# EAGLE design ArdZeroBTHIDStickBckUp (EAGLE 8.6.0)
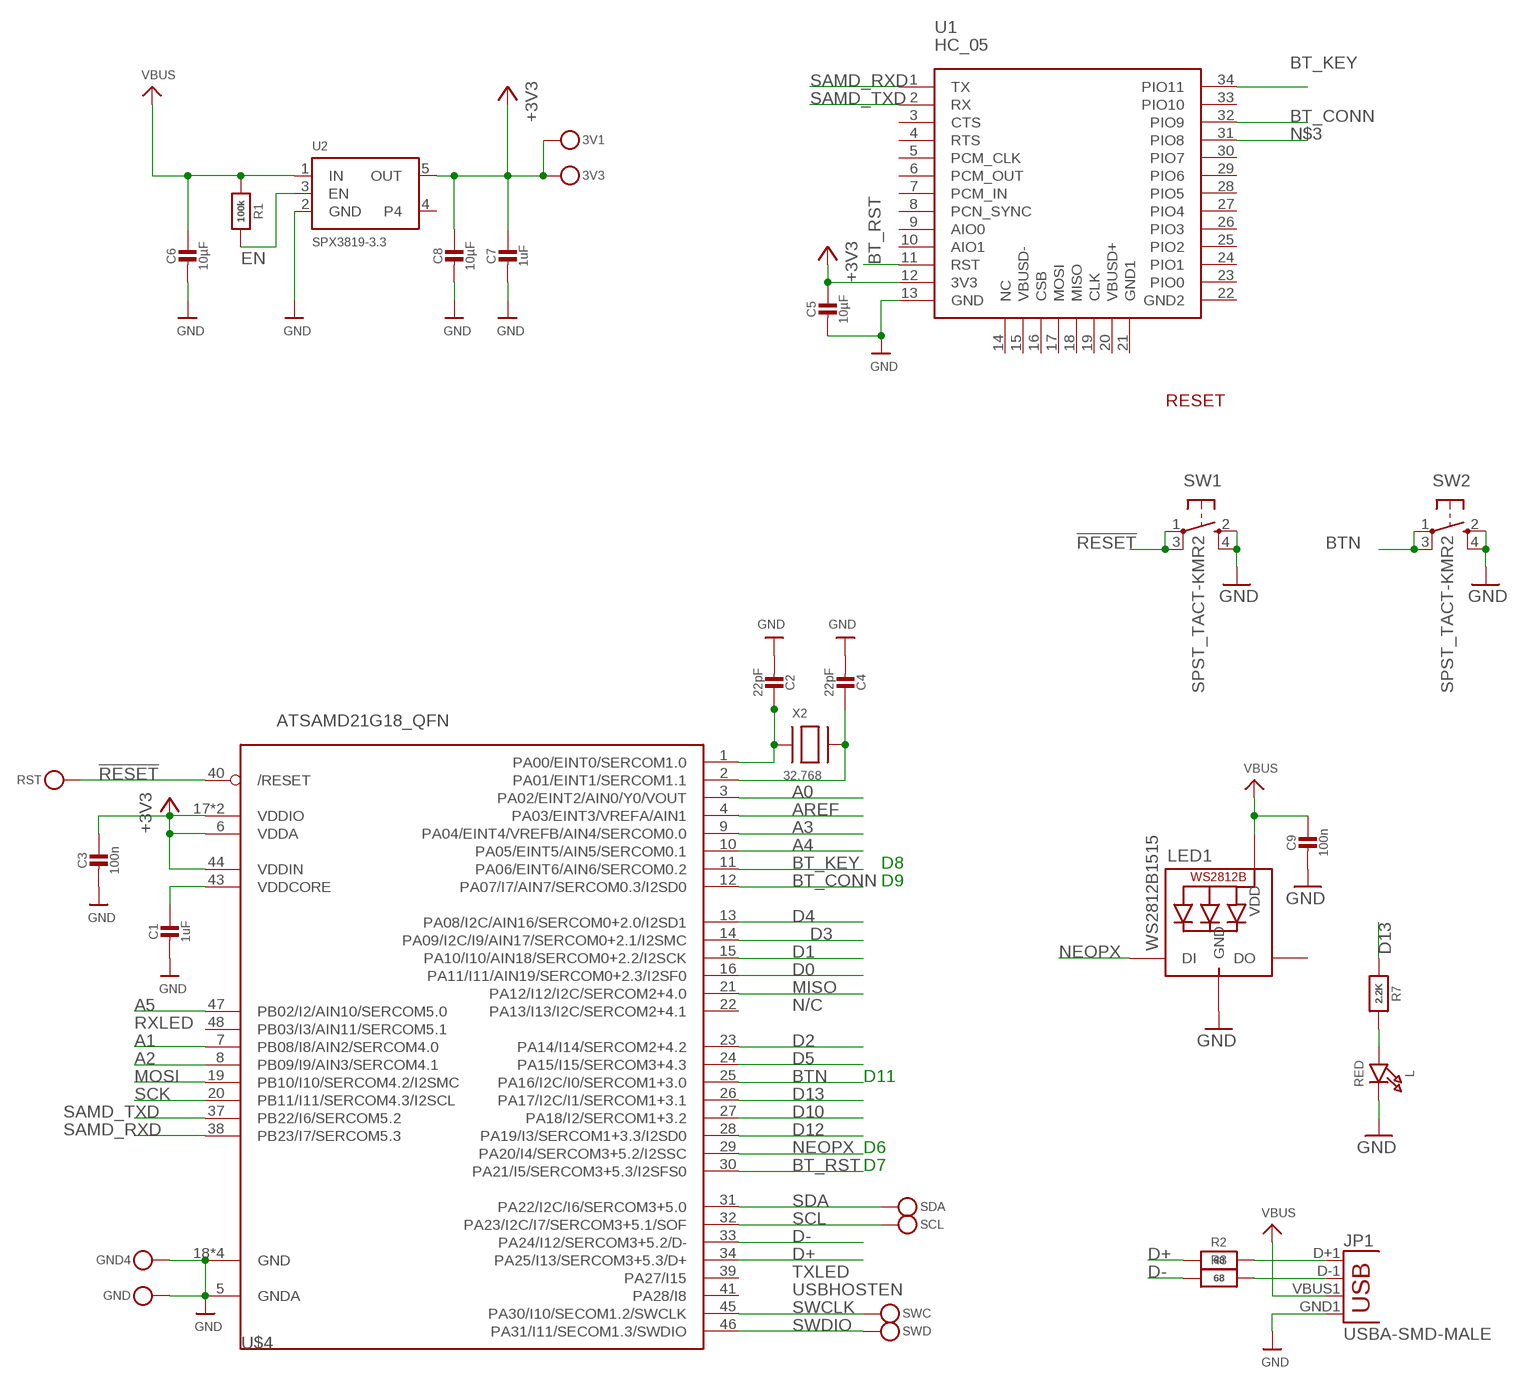
[diagram p0: schematic, sheet 1]

## Parts
3V1  TESTPOINTROUND1.5MM  [TESTPOINT_ROUND_1.5MM]
3V3  TESTPOINTROUND1.5MM  [TESTPOINT_ROUND_1.5MM]
C1  1uF  CAP_CERAMIC0603_NO  [0603-NO]
C2  22pF  CAP_CERAMIC0603_NO  [0603-NO]
C3  100n  CAP_CERAMIC0603_NO  [0603-NO]
C4  22pF  CAP_CERAMIC0603_NO  [0603-NO]
C5  10µF  CAP_CERAMIC0805-NOOUTLINE  [0805-NO]
C6  10µF  CAP_CERAMIC0805-NOOUTLINE  [0805-NO]
C7  1uF  CAP_CERAMIC0603_NO  [0603-NO]
C8  10µF  CAP_CERAMIC0805-NOOUTLINE  [0805-NO]
C9  100n  CAP_CERAMIC0603_NO  [0603-NO]
GND  TESTPOINTROUND1.5MM  [TESTPOINT_ROUND_1.5MM]
GND4  TESTPOINTROUND1.5MM  [TESTPOINT_ROUND_1.5MM]
JP1  USBA-SMD-MALE  [USB-A-SMT-MALE]
L  RED  LED0805_NOOUTLINE  [CHIPLED_0805_NOOUTLINE]
LED1  WS2812B1515  [LED1515]
R1  100k  RESISTOR_0603_NOOUT  [0603-NO]
R2  68  RESISTOR_0603_NOOUT  [0603-NO]
R3  68  RESISTOR_0603_NOOUT  [0603-NO]
R7  2.2K  RESISTOR_0603_NOOUT  [0603-NO]
RST  TESTPOINTROUND1.5MM  [TESTPOINT_ROUND_1.5MM]
SCL  TESTPOINTROUND1.5MM  [TESTPOINT_ROUND_1.5MM]
SDA  TESTPOINTROUND1.5MM  [TESTPOINT_ROUND_1.5MM]
SW1  SPST_TACT-KMR2  [KMR2]
SW2  SPST_TACT-KMR2  [KMR2]
SWC  TESTPOINTROUND1.5MM  [TESTPOINT_ROUND_1.5MM]
SWD  TESTPOINTROUND1.5MM  [TESTPOINT_ROUND_1.5MM]
U1  HC_05  [BLUETOOTH_SMD]
U2  SPX3819-3.3  VREG_SOT23-5  [SOT23-5]
U$4  ATSAMD21G18_QFN  ATSAMD21J_QFN  [TQFN48_7MM]
X2  32.768  XTAL-3.2X1.5  [XTAL3215]

## Nets
!RESET: RST.P$1 SW1.1(P) SW1.3(P1) U$4.40(/RESET)
+3V3: 3V1.P$1 3V3.P$1 C3.1 C5.1 C7.1 C8.1 U1.12(3V3) U2.5(OUT) U$4.6(VDDA) U$4.17(VDDIO) U$4.36(VDDIO) U$4.44(VDDIN)
A0: U$4.3(PA02/EINT2/AIN0/Y0/VOUT)
A1: U$4.7(PB08/I8/AIN2/SERCOM4.0)
A2: U$4.8(PB09/I9/AIN3/SERCOM4.1)
A3: U$4.9(PA04/EINT4/VREFB/AIN4/SERCOM0.0)
A4: U$4.10(PA05/EINT5/AIN5/SERCOM0.1)
A5: U$4.47(PB02/I2/AIN10/SERCOM5.0)
AREF: U$4.4(PA03/EINT3/VREFA/AIN1)
BT_CONN: U1.32(PIO9) U$4.12(PA07/I7/AIN7/SERCOM0.3/I2SD0)
BT_KEY: U1.34(PIO11) U$4.11(PA06/EINT6/AIN6/SERCOM0.2)
BT_RST: U1.11(RST) U$4.30(PA21/I5/SERCOM3+5.3/I2SFS0)
BTN: SW2.1(P) SW2.3(P1) U$4.25(PA16/I2C/I0/SERCOM1+3.0)
D0: U$4.16(PA11/I11/AIN19/SERCOM0+2.3/I2SF0)
D1: U$4.15(PA10/I10/AIN18/SERCOM0+2.2/I2SCK)
D2: U$4.23(PA14/I14/SERCOM2+4.2)
D3: U$4.14(PA09/I2C/I9/AIN17/SERCOM0+2.1/I2SMC)
D4: U$4.13(PA08/I2C/AIN16/SERCOM0+2.0/I2SD1)
D5: U$4.24(PA15/I15/SERCOM3+4.3)
D10: U$4.27(PA18/I2/SERCOM1+3.2)
D12: U$4.28(PA19/I3/SERCOM1+3.3/I2SD0)
D13: R7.1 U$4.26(PA17/I2C/I1/SERCOM1+3.1)
D+: R2.1 U$4.34(PA25/I13/SERCOM3+5.3/D+)
D-: R3.1 U$4.33(PA24/I12/SERCOM3+5.2/D-)
EN: R1.2 U2.3(EN)
GND: C1.2 C2.2 C3.2 C4.2 C5.2 C6.2 C7.2 C8.2 C9.2 GND4.P$1 GND.P$1 JP1.GND1(GND) L.C LED1.GND SW1.2(S) SW1.4(S1) SW2.2(S) SW2.4(S1) U1.13(GND) U2.2(GND) U$4.5(GNDA) U$4.18(GND) U$4.35(GND) U$4.42(GND) U$4.THERMAL(GND)
MISO: U$4.21(PA12/I12/I2C/SERCOM2+4.0)
MOSI: U$4.19(PB10/I10/SERCOM4.2/I2SMC)
N$1: JP1.D+1(D+) R2.2
N$3: U1.31(PIO8)
N$4: JP1.D-1(D-) R3.2
N$5: C2.1 U$4.1(PA00/EINT0/SERCOM1.0) X2.P$1
N$6: L.A R7.2
N$7: C4.1 U$4.2(PA01/EINT1/SERCOM1.1) X2.P$2
NEOPX: LED1.DIN(DI) U$4.29(PA20/I4/SERCOM3+5.2/I2SSC)
SAMD_RXD: U1.1(TX) U$4.38(PB23/I7/SERCOM5.3)
SAMD_TXD: U1.2(RX) U$4.37(PB22/I6/SERCOM5.2)
SCK: U$4.20(PB11/I11/SERCOM4.3/I2SCL)
SCL: SCL.P$1 U$4.32(PA23/I2C/I7/SERCOM3+5.1/SOF)
SDA: SDA.P$1 U$4.31(PA22/I2C/I6/SERCOM3+5.0)
SWCLK: SWC.P$1 U$4.45(PA30/I10/SECOM1.2/SWCLK)
SWDIO: SWD.P$1 U$4.46(PA31/I11/SECOM1.3/SWDIO)
VBUS: C6.1 C9.1 JP1.VBUS1(VBUS) LED1.VDD R1.1 U2.1(IN)
VDDCORE1: C1.1 U$4.43(VDDCORE)
Unconnected: LED1.DOUT(DO) U1.3(CTS) U1.4(RTS) U1.5(PCM_CLK) U1.6(PCM_OUT) U1.7(PCM_IN) U1.8(PCN_SYNC) U1.9(AIO0) U1.10(AIO1) U1.14(NC) U1.15(VBUSD-) U1.16(CSB) U1.17(MOSI) U1.18(MISO) U1.19(CLK) U1.20(VBUSD+) U1.21(GND1) U1.22(GND2) U1.23(PIO0) U1.24(PIO1) U1.25(PIO2) U1.26(PIO3) U1.27(PIO4) U1.28(PIO5) U1.29(PIO6) U1.30(PIO7) U1.33(PIO10) U2.4 U$4.22(PA13/I13/I2C/SERCOM2+4.1) U$4.39(PA27/I15) U$4.41(PA28/I8) U$4.48(PB03/I3/AIN11/SERCOM5.1)

## Notes on the sheet
- RESET
- D8
- D9
- N/C
- RXLED
- D11
- D6
- D7
- TXLED
- USBHOSTEN

## Library data of the parts
3V1 3V3 GND GND4 RST SCL SDA SWC SWD = microbuilder:TESTPOINT: Test Point Various test points for characterisation and PCB testing TESTPOINT_SMT - Compact Surface Mount Test Point [Digikey: 5016KTR-ND]
C1-C9 = microbuilder:CAP_CERAMIC: Ceramic Capacitors For new designs, use the packages preceded by an '_' character since they are more reliable: The following footprints should be used on most boards: _0402 - Standard footprint for regular board layouts _0603 - Standard footprint for regular board layouts _0805 - Standard footprint for regular board layouts _1206 - Standard footprint for regular board layouts For extremely tight-pitch boards where space is at a premium, the following 'micro-pitch' footprints can be used (smaller pads, no silkscreen outline, etc.): _0402MP - Micro-pitch footprint for very dense/compact boards _0603MP - Micro-pitch footprint for very dense/compact boards _0805MP - Micro-pitch footprint for very dense/compact boards _1206MP - Micro-pitch footprint for very dense/compact boards
JP1 = SparkFun-Connectors:USB: USB Connectors USB-B-PTH is fully proven SKU : PRT-00139/CONN-08278 USB-miniB is fully proven SKU : PRT-00587 USB-A-PCB is untested. USB-A-H is throughly reviewed, but untested. Spark Fun Electronics SKU : PRT-00437 USB-B-SMT is throughly reviewed, but untested. Needs silkscreen touching up. USB-A-S has not been used/tested USB-MB-H has not been used/tested USB-MICROB has been used. CONN-09505
L = microbuilder:LED: LED 0603 - 0603 Surface Mount Package 2mA: Green LED - Low Power (3.9mcd, 2ma, 1.7Vf) - Digikey: 475-2709-2-ND Orange LED - Low Power (9.8mcd, 2ma, 1.8Vf) - Digikey: 475-1194-2-ND Red LED - Low Power (5mcd, 2ma, 1.8Vf) - Digikey: 475-1195-2-ND Yellow LED - Low Power (7mcd, 2ma, 1.8Vf) - Digikey: 475-1196-2-ND 5mA: Blue LED - Low Power (17mcd, 5ma, 2.9Vf) - Digikey: LNJ937W8CRACT-ND 0805 - 0805 Surface Mount Package 2mA: Red LED (8.8mcd, 2mA, 1.8Vf, Clear) - Low Power [Digikey: 475-2510-1-ND] Green LED (5mcd, 2mA, 1.8Vf, Clear) - Low Power [Digikey: 475-2730-1-ND] Yellow LED (11.3mcd, 2mA, 1.8Vf, Clear) - Low Power [Digikey: 475-2555-1-ND] 20mA: Red LED (104mcd, 20mA, Diffused) - LS R976 [Digikey: 475-1278-6-ND] Red LED (12mcd, 20mA, 2.0Vf, Clear) - APT2012EC [Digikey: 754-1128-1-ND] Green LED (15mcd, 20mA, 2.2Vf, Clear) - APT2012GC [Digikey: 754-1131-1-ND] Orange LED (160mcd, 20mA, 2.1Vf, Clear) - APT2012SECK [Digikey: 754-1130-1-ND] 1206 - 1206 Surface Mount Package Green LED (26mcd, 20mA, Diffused) - LG N971 [Digikey: 475-1407-6-ND] Red LED (15mcd, 20mA, Diffused) - LH N974 [Digikey: 475-1416-6-ND] Cree - Cree High-Power Surface Mount LEDs XPEBWT-L1-0000-00D50 - White 111lm 350mA 2.9Vf 6200K 110° XTEAWT-00-0000-00000LEE3 - White 114lm 350mA 2.85Vf 5000K 115° Everlight - Everlight 45-21 Series Surface Mount LEDs 45-21/QK2C-B2832AC2CB2/2T - Warm White 2000mcd 20mA 3.25Vf 3050K 120° 45-21/LK2C-B38452C4CB2/2T - Nuetral White 2000mcd 20mA 3.25Vf 4150K 120° 45-21/LK2C-B50634C6CB2/2T - Cold White 2200mcd 20mA 3.25Vf 5650K 120° PLCC2 Reverse Mount LS T77K-J1L2-1-0-2-R18-Z - Red 11.25mcd 2mA 1.8Vf 630nm 120° LO T77K-L1M2-24-Z - Orange 19.6mcd 2mA 1.8Vf 606nm 120° LY T77K-K2M1-26-Z - Yellow 15.7mcd 2mA 1.8Vf 587nm 120°
LED1 = WS2812_1515:WS2812B
R1-R3 R7 = microbuilder:RESISTOR: Resistors For new designs, use the packages preceded by an '_' character since they are more reliable: The following footprints should be used on most boards: _0402 - Standard footprint for regular board layouts _0603 - Standard footprint for regular board layouts _0805 - Standard footprint for regular board layouts _1206 - Standard footprint for regular board layouts For extremely tight-pitch boards where space is at a premium, the following 'micro-pitch' footprints can be used (smaller pads, no silkscreen outline, etc.): _0402MP - Micro-pitch footprint for very dense/compact boards _0603MP - Micro-pitch footprint for very dense/compact boards _0805MP - Micro-pitch footprint for very dense/compact boards _1206MP - Micro-pitch footprint for very dense/compact boards
SW1 SW2 = adafruit:SPST_TACT: SMT 6mm switch, EVQQ2 series http://www.ladyada.net/library/eagle
U1 = Bluetooth HC-05:HC_05: HC-05 Bluetooth Module
U2 = microbuilder:VREG_SOT23-5: SOT23-5 Fixed Voltage Regulators Part Current Out V Out V In V Dropout θJA (°C/W) TJ (°C) Digikey Part No. ADP121 150mA 3.3V 3.4-5.5V 0.09V @ 150mA -- -- ADP121-AUJZ33R7CT-ND ADP121 150mA 3.0V 3.1-5.5V 0.09V @ 150mA -- -- ADP121-AUJZ30R7CT-ND ADP122 300mA 3.3V 3.4-5.5V 0.085V @ 300mA -- -- ADP122AUJZ-3.3-R7CT-ND ADP1712 300mA 3.3V 3.5-5.5V 0.17V @ 300mA -- -- ADP1712AUJZ-3.3-R7TR-ND AP7311 (Low Cost) 150mA 3.3V 3.5-6V 0.15V @ 150mA -- -- AP7311-33WG-7DICT-ND LD39015M18R 150mA 1.8V 1.9V-5.5V 0.08V @ 100mA -- -- 497-6977-1-ND LP2985A-33DBVR 150mA 3.3V 3.3-16V 0.28V @ 150mA 206 150 296-18479-1-ND MCP1824T-3302E/OT 300mA 3.3V 3.5V-6V 0.2V @ 300mA -- -- MCP1824T-3302E/OTCT-ND MIC5205-2.5YM5 TR 150mA 2.5V 2.7-16V 0.165V @ 150mA -- -- 576-1257-2-ND MIC5205-3.0YM5 TR 150mA 3.0V 3.2V-16V 0.165V @ 150mA -- -- 576-1258-2-ND MIC5205-3.3YM5 TR 150mA 3.3V 3.5V-16V 0.165V @ 150mA -- -- 576-1259-2-ND TPS780330220 150mA 3.3V+2.2V 3.6-5.5V 250mV Max -- -- 296-23332-1-ND TDA3663/N1,135 100mA 3.3V 3.5-45V 0.18V @ 50mA -- -- 568-5343-1-ND Max operating temp can be calculated using θJA, TJ (max junction temperature), and power in watts. Set the "Maximum Ambient Temperature" until it reaches TJ ("Max Junction Temperature"), which is the absolute limit for safe use of the regulator: Heat Sink Temperature Calculator <http://www.daycounter.com/Calculators/Heat-Sink-Temperature-Calculator.phtml> For example, With 12V source into a 3.3V LP2985 and a 30mA load, we are dissipating (12V-3.3V) * 0.03A = 0.261W. With a θJA of 206 °C/W, a TJ of 150°C, and 261mW we can safely use the chip without a heat sink up to 75°C (=147.1°C Junction Temperature).
U$4 = microbuilder:ATSAMD21J
X2 = adafruit2:XTAL: Low cost SMT crystals, no capacitors included http://www.ladyada.net/library/eagle

## Board
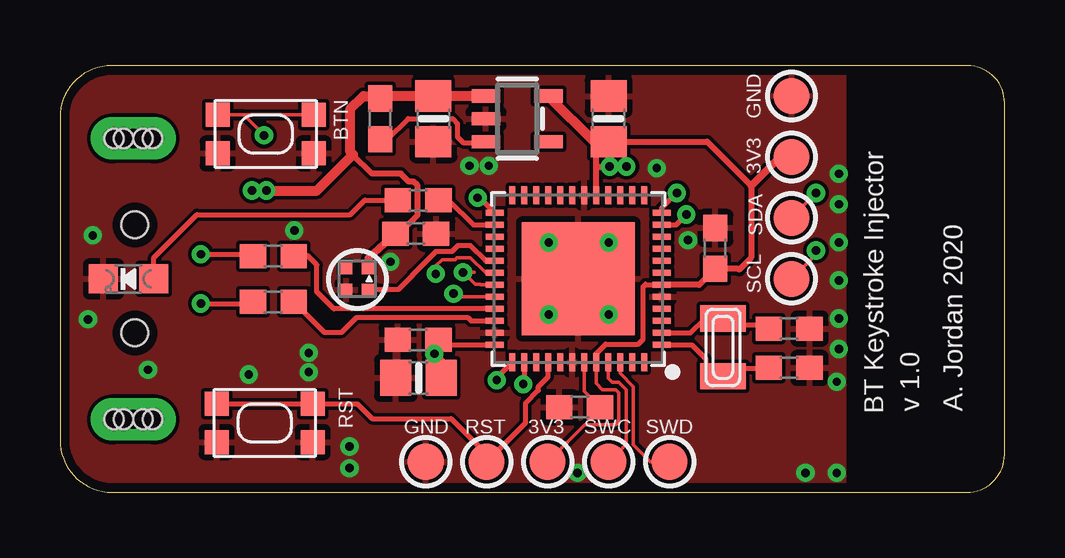
[diagram p1: board, top side]
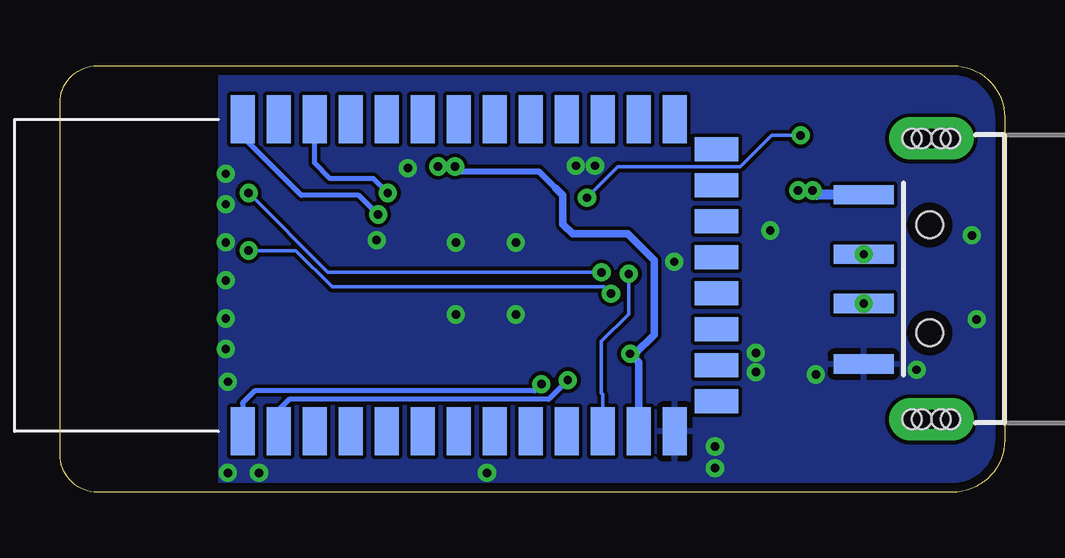
[diagram p2: board, bottom side, seen from below]

Size 39.36 x 17.77 mm. Coordinates in mm from the lower left corner, seen from the top.
Outline: 0,15.62 0,2.17 arc90 2.17,0 37.79,0 arc90 39.36,1.57 39.36,16.22 arc90 37.81,17.77 2.15,17.77 arc90 0,15.62
Copper layers (1*16): Top 0.035mm / dielectric 1.5mm / Bottom 0.035mm
Design rules "default *": minimum track width 6mil, minimum drill 0.35mm, track to track 6mil, track to pad 6mil, pad to pad 6mil, via to via 6mil, smd to smd 6mil, copper to edge 15mil, drill to drill 6mil, minimum pad ring 10mil, minimum via ring 8mil, stop-mask expansion 4mil, vias tented up to drill 20mil, thermal gap 10mil

### Footprints (pad centres in the part's own frame; a part is rotated, then mirrored left to right if it is on the bottom)
TESTPOINT_ROUND_1.5MM = smd 1.5 x 1.5: P$1 0,0
0603-NO = smd 1.1 x 1: 1 -0.85,0; 2 0.85,0
0805-NO = smd 1.3 x 1.5: 1 -0.95,0; 2 0.95,0
USB-A-SMT-MALE = smd 0.8 x 2.5: D+1 1.027,-5.87; D-1 -1.027,-5.87; GND1 3.551,-5.87; VBUS1 -3.5,-5.87 | drill 0.8 pad 1.778 long: P$1 5.85,-3.05; P$3 -5.85,-3.05 | hole 1.1: 2.25,-3.12; -2.25,-3.12 | hole 0.8: -5.85,-3.45; -5.85,-3.85; -5.85,-2.65; -5.85,-2.25; 5.85,-3.45; 5.85,-3.85; 5.85,-2.65; 5.85,-2.25
CHIPLED_0805_NOOUTLINE = smd 1.2 x 1.2: A 0,-1.05; C 0,1.05
LED1515 = smd 0.5 x 0.5: DIN 0.45,0.45; DOUT -0.45,-0.45; GND 0.45,-0.45; VDD -0.45,0.45
KMR2 = smd 1 x 1: 1 2,0.8; 2 2,-0.8; 3 -2,0.8; 4 -2,-0.8
BLUETOOTH_SMD = smd 2 x 1: 1 -6.35,3.81; 2 -6.35,2.31; 3 -6.35,0.81; 4 -6.35,-0.69; 5 -6.35,-2.19; 6 -6.35,-3.69; 7 -6.35,-5.19; 8 -6.35,-6.69; 9 -6.35,-8.19; 10 -6.35,-9.69; 11 -6.35,-11.19; 12 -6.35,-12.69; 13 -6.35,-14.19; 22 6.65,-14.19; 23 6.65,-12.69; 24 6.65,-11.19; 25 6.65,-9.69; 26 6.65,-8.19; 27 6.65,-6.69; 28 6.65,-5.19; 29 6.65,-3.69; 30 6.65,-2.19; 31 6.65,-0.69; 32 6.65,0.81; 33 6.65,2.31; 34 6.65,3.81 | smd 1 x 1.8: 14 -5.1,-15.94; 15 -3.6,-15.94; 16 -2.1,-15.94; 17 -0.6,-15.94; 18 0.9,-15.94; 19 2.4,-15.94; 20 3.9,-15.94; 21 5.4,-15.94
SOT23-5 = smd 0.55 x 1.2: 1 -0.95,-1.3; 2 0,-1.3; 3 0.95,-1.3; 4 0.95,1.3; 5 -0.95,1.3
TQFN48_7MM = smd 0.25 x 0.75: 1 -2.75,-3.475; 2 -2.25,-3.475; 3 -1.75,-3.475; 4 -1.25,-3.475; 5 -0.75,-3.475; 6 -0.25,-3.475; 7 0.25,-3.475; 8 0.75,-3.475; 9 1.25,-3.475; 10 1.75,-3.475; 11 2.25,-3.475; 12 2.75,-3.475; 25 2.75,3.475; 26 2.25,3.475; 27 1.75,3.475; 28 1.25,3.475; 29 0.75,3.475; 30 0.25,3.475; 31 -0.25,3.475; 32 -0.75,3.475; 33 -1.25,3.475; 34 -1.75,3.475; 35 -2.25,3.475; 36 -2.75,3.475 | smd 0.75 x 0.25: 13 3.475,-2.75; 14 3.475,-2.25; 15 3.475,-1.75; 16 3.475,-1.25; 17 3.475,-0.75; 18 3.475,-0.25; 19 3.475,0.25; 20 3.475,0.75; 21 3.475,1.25; 22 3.475,1.75; 23 3.475,2.25; 24 3.475,2.75; 37 -3.475,2.75; 38 -3.475,2.25; 39 -3.475,1.75; 40 -3.475,1.25; 41 -3.475,0.75; 42 -3.475,0.25; 43 -3.475,-0.25; 44 -3.475,-0.75; 45 -3.475,-1.25; 46 -3.475,-1.75; 47 -3.475,-2.25; 48 -3.475,-2.75 | smd 4.7 x 4.7: THERMAL 0,0
XTAL3215 = smd 1.1 x 1.9: P$1 1.2,0; P$2 -1.2,0

### Placement (x,y rotation side)
3V1  30.48,13.97 0 top
3V3  20.32,1.27 0 top
C1  21.65,3.55 180 top
C2  30.38,5.18 0 top
C3  27.3,10.16 90 top
C4  30.38,6.82 0 top
C5  14.94,4.76 180 top
C6  15.56,15.56 270 top
C7  14.92,6.35 180 top
C8  22.86,15.56 90 top
C9  14.82,10.78 0 top
GND  15.24,1.27 0 top
GND4  30.48,16.51 0 top
JP1  0,8.89 270 bottom
L  2.86,8.89 90 top
LED1  12.38,8.89 270 top
R1  13.34,15.56 270 top
R2  8.89,7.94 180 top
R3  8.89,9.84 180 top
R7  14.92,12.16 180 top
RST  17.78,1.27 0 top
SCL  30.48,8.89 0 top
SDA  30.48,11.43 0 top
SW1  8.53,2.88 0 top
SW2  8.57,14.92 0 top
SWC  22.86,1.27 0 top
SWD  25.4,1.27 0 top
U1  27.94,8.89 90 bottom
U2  19.05,15.56 270 top
U$4  21.59,8.89 90 top
X2  27.62,6.03 270 top

### Tracks (layer width: path | path; a pad name or v marks a point on that pad's centre or on a via)
!RESET
  Top 0.203: SW1.3 SW1.1 12.39,3.68 13,3.07 16.3,3.07 17.78,1.59 RST.P$1 19.4,2.89 19.4,3.71 19.93,4.24 19.93,4.4 20.34,4.81 U$4.40
+3V3  (via drill 0.35)
  Top 0.152: U$4.44 22.34,4.54 22.6,4.28 23.15,4.28 23.28,4.14 23.28,2.96 23.15,2.82 21.87,2.82 3V3.P$1 | v23.6,13.57 v22.9,13.57
  Top 0.203: C7.1 15.83,6.3 15.98,6.14 U$4.36 | U$4.6 24.43,8.64 24.4,8.67 24.3,8.57 24.3,6.37 24.1,6.17 22.74,6.17 22.34,5.77 U$4.44
  Top 0.254: U$4.17 22.34,13.57 | 22.34,13.57 22.34,14.35 22.6,14.61 | C8.1 26.96,14.61 28.8,12.77 28.8,9.77 28.3,9.27 28.26,9.31 C3.1 26.64,8.64 U$4.6 | 22.34,13.57 v22.9,13.57
  Top 0.305: 15.83,6.3 15.83,6 v15.6,5.77 15.89,5.48 C5.1 | 28.8,12.77 30,13.97 3V1.P$1
  Top 0.406: U2.5 22.25,14.61 22.6,14.61 C8.1
  Bottom 0.254: v22.9,13.57 22.7,13.37 19.4,13.37 18.7,12.67
  Bottom 0.305: U1.12 15.25,5.42 v15.6,5.77 15.4,5.77 14.6,6.57 14.6,9.67 15.7,10.77 18,10.77 18.4,11.17 18.4,12.37 18.7,12.67
BT_CONN  (via drill 0.35)
  Top 0.203: U$4.12 25.07,11.83 v25.7,12.47
  Bottom 0.203: v25.7,12.47 26.3,13.07 28.1,13.07 28.75,13.72 U1.32
BT_KEY  (via drill 0.35)
  Top 0.203: U$4.11 25.67,11.14 v26.1,11.57
  Bottom 0.203: v26.1,11.57 26.9,12.37 29.3,12.37 31.75,14.82 U1.34
BT_RST  (via drill 0.35)
  Top 0.152: U$4.30 17.73,9.14 17.1,9.77 16.54,9.77 16.46,9.69 15.92,9.69 15.66,9.43 v15.66,9.1
  Bottom 0.152: v15.66,9.1 15.66,7.43 16.8,6.28 16.8,4.13 16.75,4.08 U1.11
BTN  (via drill 0.35)
  Top 0.152: v8.5,14.87 7.65,15.72 SW2.3 SW2.1
  Top 0.203: U$4.25 17.48,12.27 v17.4,12.27
  Bottom 0.152: v8.5,14.87 9.7,14.87 11.01,13.56 16.11,13.56 v17.4,12.27
D13
  Top 0.203: R7.1 16.2,12.16 17.23,11.14 U$4.26
D+
  Top 0.203: R2.1 11.01,6.67 11.75,6.67 12.36,7.28 12.38,7.28 16.99,7.28 17.13,7.14 U$4.34
D-
  Top 0.203: U$4.33 11.41,7.64 10.7,8.35 10.7,9.47 10.3,9.87 10.27,9.84 R3.1
EN
  Top 0.203: R1.2 13.64,14.71 14.5,15.57 16.35,15.57 16.56,15.36 16.56,14.81 16.8,14.57 17.71,14.57 U2.3
GND  (via drill 0.35)
  other vias: 12.06,1.91 17.07,13.61 17.86,13.61 3.67,5.11 7.87,4.9 13.77,9.61 20.36,10.4 22.86,10.4 22.86,7.4 20.36,7.4 21.57,0.8 12.06,1 26.16,10.5 32.37,4.61 32.45,5.97 32.45,7.24 32.45,8.82 32.45,10.41 32.45,12 32.45,13.27 1.36,10.71 1.17,7.21 10.37,5.8 10.37,5 32.37,0.8 31.07,0.8 24.86,13.5 9.77,10.9
  pour Top: -2.22,21.59 -2.22,-2.54 32.7,-2.54 32.7,21.27
  pour Bottom: -1.27,20.64 -1.27,-1.27 32.7,-1.27 32.7,20.32 32.7,20.64
N$1  (via drill 0.35)
  Top 0.203: JP1.D+1 7.96,7.86 R2.2
  other vias: 5.87,7.86
N$4  (via drill 0.35)
  Top 0.203: JP1.D-1 7.96,9.92 R3.2
  other vias: 5.87,9.92
N$5
  Top 0.203: U$4.1 26.33,6.14 26.9,5.57 26.9,5.27 27.34,4.83 X2.P$1 28.06,4.83 28.4,5.17 29.32,5.17 C2.1
N$6
  Top 0.203: L.A 3.91,9.78 5.7,11.57 | 5.7,11.57 5.71,11.56 | 5.7,11.57 12.1,11.57 12.7,12.17 R7.2
N$7
  Top 0.203: U$4.2 26.27,6.64 26.86,7.23 X2.P$2 27.89,6.97 29.18,6.97 C4.1
NEOPX
  Top 0.203: U$4.29 17.73,9.64 17.1,10.27 16.57,10.27 16.33,10.02 15.65,10.02 14.7,9.07 14.7,9.04 14.09,8.44 LED1.DIN
SAMD_RXD  (via drill 0.35)
  Top 0.203: U$4.38 19.34,4.54 v19.3,4.5
  Bottom 0.203: v19.3,4.5 19.58,4.23 31.24,4.23 31.75,3.72 U1.1
SAMD_TXD  (via drill 0.35)
  Top 0.203: U$4.37 18.2,4.78 v18.2,4.67
  Bottom 0.203: v18.2,4.67 19,3.87 29.8,3.87 30.3,3.37 30.25,3.32 U1.2
SCL  (via drill 0.35)
  Top 0.152: SCL.P$1 31.5,9.91 v31.5,10.07 | U$4.32 16.53,8.14 v16.4,8.27
  Bottom 0.152: v31.5,10.07 29.53,10.07 28.02,8.56 16.68,8.56 v16.4,8.27
SDA  (via drill 0.35)
  Top 0.152: 17.27,9.16 v16.8,9.16 | v16.8,9.16 v16.79,9.16 | v31.5,12.47 30.48,11.45 SDA.P$1 | U$4.31 17.53,8.64 17.5,8.67 17.29,8.67 v16.8,9.16
  Bottom 0.152: v16.79,9.16 28.19,9.16 v31.5,12.47
SWCLK
  Top 0.152: U$4.45 22.84,4.74 23,4.58 23.27,4.58 23.59,4.27 23.59,2 SWC.P$1
SWDIO
  Top 0.152: U$4.46 23.34,4.95 23.89,4.4 23.89,1.98 24.6,1.27 SWD.P$1
VBUS  (via drill 0.35)
  Top 0.152: v8,12.57 v8.6,12.57
  Top 0.254: C9.1 14.07,10.72 14.9,11.55 14.9,12.78 14.74,12.94 14.53,12.94 14.2,13.27 13,13.27 12.2,14.07 12.1,14.17
  Top 0.305: LED1.VDD 12.84,9.74 C9.1
  Top 0.406: U2.1 C6.1 13.44,16.51 | 13.44,16.51 R1.1 | 12.1,14.17 12.1,15.97 12.64,16.51 13.44,16.51 | 12.2,14.07 10.7,12.57 v8.6,12.57
  Bottom 0.406: JP1.VBUS1 7.82,12.39 v8,12.57
VDDCORE1
  Top 0.152: U$4.43 21.84,4.21 C1.1

### Text on the board
tPlace: GND | BTN | 3V3 | BT Keystroke Injector | v 1.0 | A. Jordan 2020 | RST